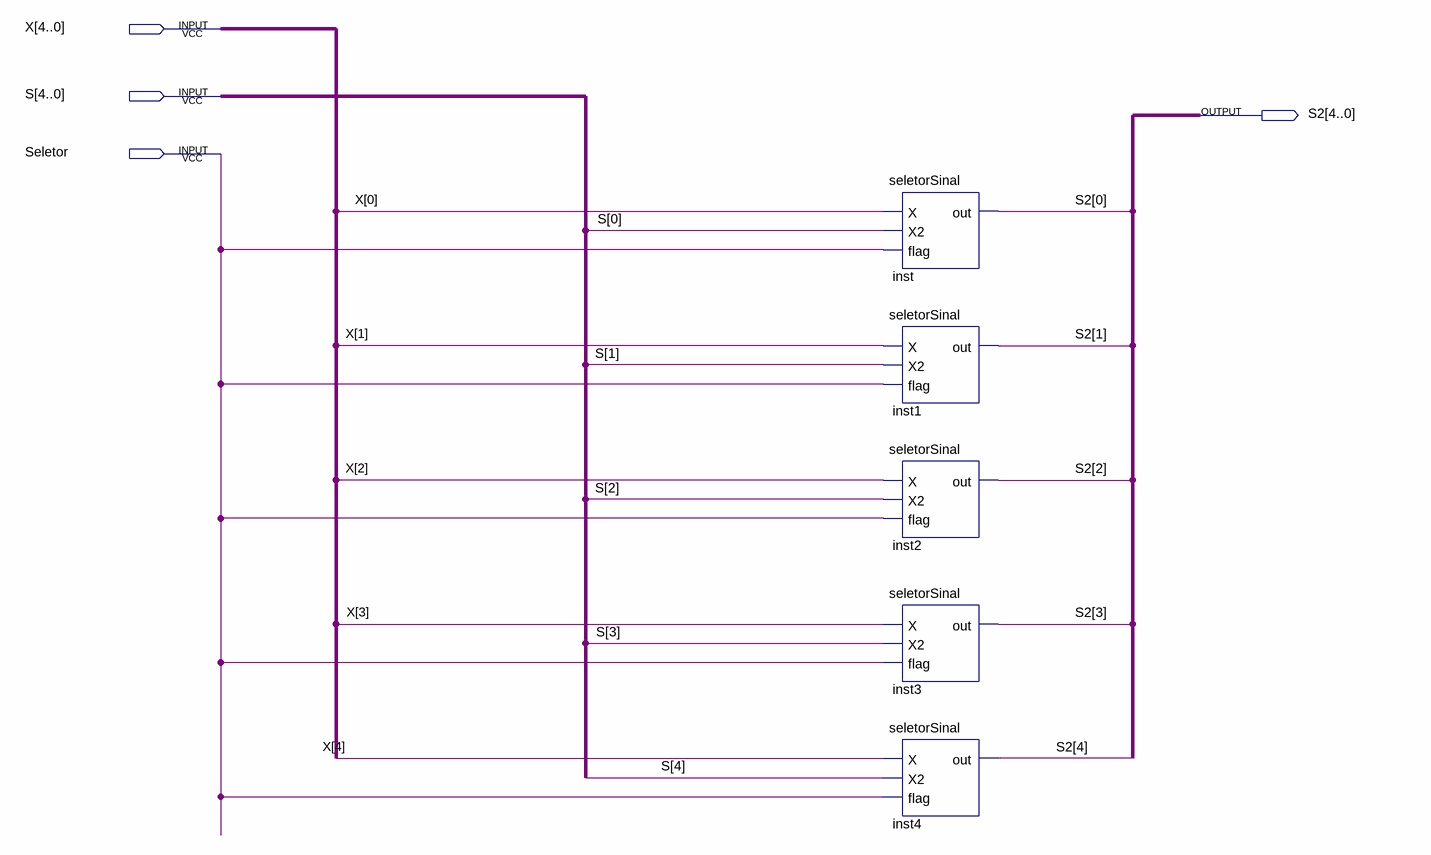
[diagram p0: schematic sheet]
// Quartus schematic VerificaSinal2.bdf as structural Verilog: 5 symbols, 4 pins
module VerificaSinal2 (
  input  [4:0] X,
  input  [4:0] S,
  input  Seletor,
  output [4:0] S2
);

  seletorSinal inst (.X(X[0]), .X2(S[0]), .flag(Seletor), .out(S2[0]));
  seletorSinal inst1 (.X(X[1]), .X2(S[1]), .flag(Seletor), .out(S2[1]));
  seletorSinal inst2 (.X(X[2]), .X2(S[2]), .flag(Seletor), .out(S2[2]));
  seletorSinal inst3 (.X(X[3]), .X2(S[3]), .flag(Seletor), .out(S2[3]));
  seletorSinal inst4 (.X(X[4]), .X2(S[4]), .flag(Seletor), .out(S2[4]));
endmodule
